# Altium schematic sheet USB Type C Connector ESD.SchDoc
size Tabloid; ApprovedBy: NA
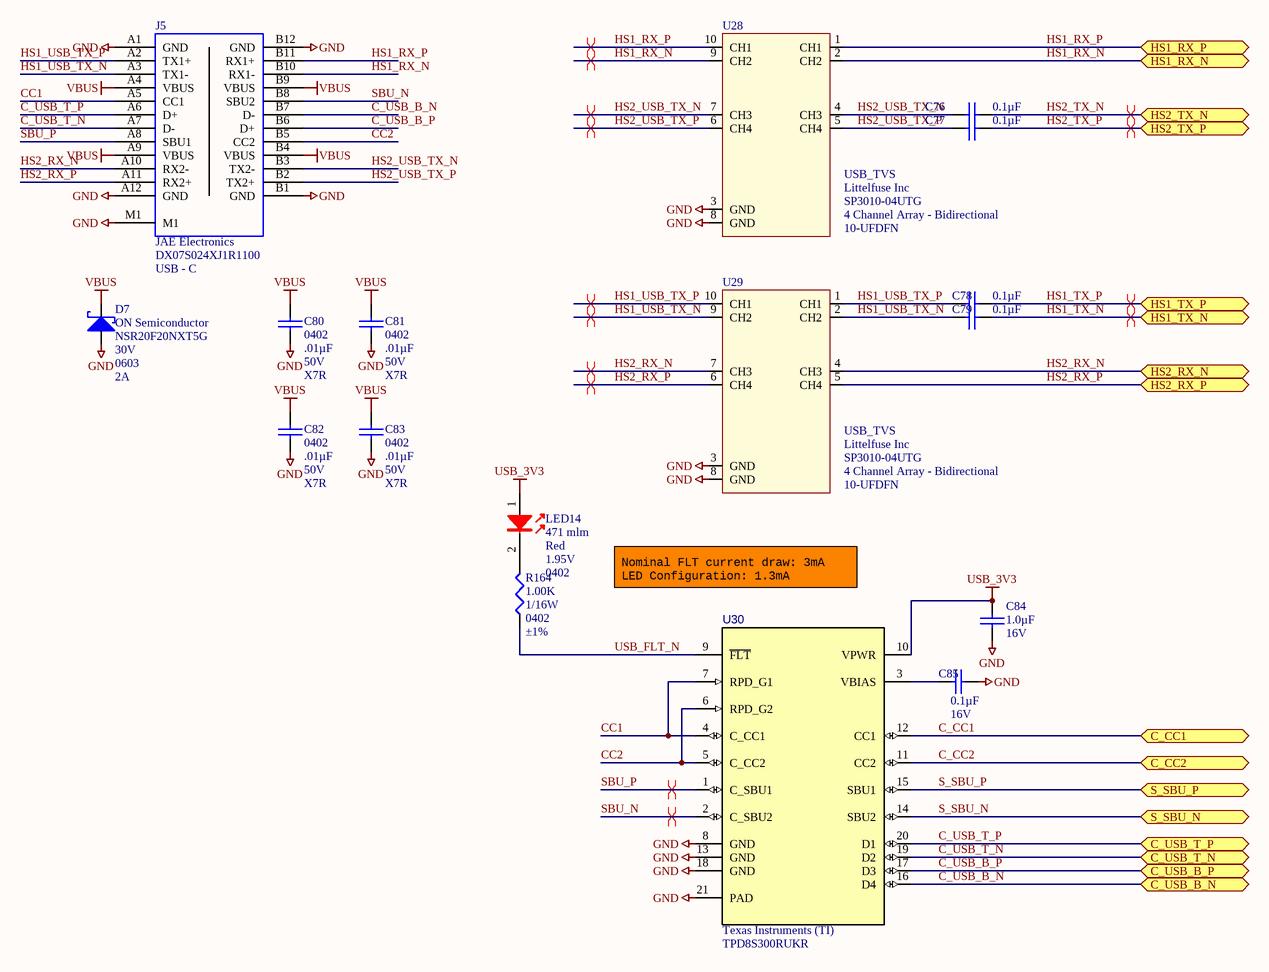
[diagram p0: USB Type C Connector ESD.SchDoc]

## Parts
C76  Capacitance: 0.1µF  [CAPC0201]  (hidden comment: 0.1UF)
C77  Capacitance: 0.1µF  [CAPC0201]  (hidden comment: 0.1UF)
C78  Capacitance: 0.1µF  [CAPC0201]  (hidden comment: 0.1UF)
C79  Capacitance: 0.1µF  [CAPC0201]  (hidden comment: 0.1UF)
C80  Package / Case: 0402  Capacitance: .01µF  Voltage - Rated: 50V  Temperature Coefficient: X7R  [C_ERA-0402]  (hidden comment: 10000pF)
C81  Package / Case: 0402  Capacitance: .01µF  Voltage - Rated: 50V  Temperature Coefficient: X7R  [C_ERA-0402]  (hidden comment: 10000pF)
C82  Package / Case: 0402  Capacitance: .01µF  Voltage - Rated: 50V  Temperature Coefficient: X7R  [C_ERA-0402]  (hidden comment: 10000pF)
C83  Package / Case: 0402  Capacitance: .01µF  Voltage - Rated: 50V  Temperature Coefficient: X7R  [C_ERA-0402]  (hidden comment: 10000pF)
C84  Capacitance: 1.0µF  Voltage - Rated: 16V  [C_ERA-0402]  (hidden comment: 1.0uF)
C85  Capacitance: 0.1µF  Voltage - Rated: 16V  [C_0402]  (hidden comment: 0.1uF)
D7  Reverse Voltage (DC): 30V  Manufacturer: ON Semiconductor  Manufacturer Part Number: NSR20F20NXT5G  Case/Package: 0603  Average Rectified Current: 2A  [DSN2_0603]  (hidden comment: D_SCHOTT_30V_2A_XDFN)
J5  Manufacturer: JAE Electronics  Connector Type: USB - C  [DX07S024XJ1R1100]  (hidden comment: J_DX07S024XJ1R1100)
LED14  Luminous Flux @ Current - Test: 471 mlm  Color: Red  Voltage - Forward (Vf) Typ: 1.95V  Package / Case: 0402  [DIOM1005X07L_RED]  (hidden comment: LED_RED_0402)
R164  Resistance In Ohms: 1.00K  Power (Watts): 1/16W  Case: 0402  Tolerance: ±1%  [R_0402]  (hidden comment: 1.0k Ohms)
U28  USB_TVS  Manufacturer: Littelfuse Inc  Manufacturer Part Number: SP3010-04UTG  Polarization: 4 Channel Array - Bidirectional  Package / Case: 10-UFDFN  [TVS_DIODE_USB3.0-10]
U29  USB_TVS  Manufacturer: Littelfuse Inc  Manufacturer Part Number: SP3010-04UTG  Polarization: 4 Channel Array - Bidirectional  Package / Case: 10-UFDFN  [TVS_DIODE_USB3.0-10]
U30  Manufacturer: Texas Instruments (TI)  Manufacturer Part Number: TPD8S300RUKR  [RUK0020B]  (hidden comment: U_TPD8S300RUK)

## Ports
C_CC1, C_CC2, C_USB_B_N, C_USB_B_P, C_USB_T_N, C_USB_T_P, HS1_RX_N, HS1_RX_P, HS1_TX_N, HS1_TX_P, HS2_RX_N, HS2_RX_P, HS2_TX_N, HS2_TX_P, S_SBU_N, S_SBU_P

## Nets
GND: C80.1 C81.1 C82.1 C83.1 C84.1 C85.1 D7.A J5.A1(GND) J5.A12(GND) J5.B1(GND) J5.B12(GND) J5.M1 U28.3(GND) U28.8(GND) U29.3(GND) U29.8(GND) U30.8(GND) U30.13(GND) U30.18(GND) U30.21(PAD)
USB_3V3: C84.2 LED14.1 U30.10(VPWR)
VBUS: C80.2 C81.2 C82.2 C83.2 D7.C J5.A4(VBUS) J5.A9(VBUS) J5.B4(VBUS) J5.B9(VBUS)
C_CC1: U30.12(CC1) ; port C_CC1
C_CC2: U30.11(CC2) ; port C_CC2
C_USB_B_N: J5.B7(D-) U30.16(D4) ; port C_USB_B_N
C_USB_B_P: J5.B6(D+) U30.17(D3) ; port C_USB_B_P
C_USB_T_N: J5.A7(D-) U30.19(D2) ; port C_USB_T_N
C_USB_T_P: J5.A6(D+) U30.20(D1) ; port C_USB_T_P
CC1: J5.A5(CC1) U30.4(C_CC1) U30.7(RPD_G1)
CC2: J5.B5(CC2) U30.5(C_CC2) U30.6(RPD_G2)
HS1_RX_N: J5.B10(RX1-) U28.2(CH2) U28.9(CH2) ; port HS1_RX_N
HS1_RX_P: J5.B11(RX1+) U28.1(CH1) U28.10(CH1) ; port HS1_RX_P
HS1_TX_N: C79.2 ; port HS1_TX_N
HS1_TX_P: C78.2 ; port HS1_TX_P
HS1_USB_TX_N: C79.1 J5.A3(TX1-) U29.2(CH2) U29.9(CH2)
HS1_USB_TX_P: C78.1 J5.A2(TX1+) U29.1(CH1) U29.10(CH1)
HS2_RX_N: J5.A10(RX2-) U29.4(CH3) U29.7(CH3) ; port HS2_RX_N
HS2_RX_P: J5.A11(RX2+) U29.5(CH4) U29.6(CH4) ; port HS2_RX_P
HS2_TX_N: C76.2 ; port HS2_TX_N
HS2_TX_P: C77.2 ; port HS2_TX_P
HS2_USB_TX_N: C76.1 J5.B3(TX2-) U28.4(CH3) U28.7(CH3)
HS2_USB_TX_P: C77.1 J5.B2(TX2+) U28.5(CH4) U28.6(CH4)
S_SBU_N: U30.14(SBU2) ; port S_SBU_N
S_SBU_P: U30.15(SBU1) ; port S_SBU_P
SBU_N: J5.B8(SBU2) U30.2(C_SBU2)
SBU_P: J5.A8(SBU1) U30.1(C_SBU1)
USB_FLT_N: R164.2 U30.9(~{FLT})
NetC85_2: C85.2 U30.3(VBIAS)
NetLED14_2: LED14.2 R164.1

## Layout directives
differential pair: HS1_RX_N, HS1_RX_P, HS1_TX_N, HS1_TX_P, HS1_USB_TX_N, HS1_USB_TX_P, HS2_RX_N, HS2_RX_P, HS2_TX_N, HS2_TX_P, HS2_USB_TX_N, HS2_USB_TX_P, SBU_N, SBU_P

## Notes on the sheet
- Nominal FLT current draw: 3mA
  LED Configuration: 1.3mA
- Project:
- http://www.cospandesign.com
- Cospan Design
- Document:
- Engineer:
- Title:
- Client:
- Approved By:
- Revision:
- Date:
- Number:
- of

## Library data of the parts
C76-C79 = C_0201_0.1UF: CAP CER 0.1UF 6.3V 10% X5R 0201; Manufacturer: TDK Corporation; Manufacturer Part Number: C0603X5R0J104M; Tolerance: ±20%; Supplier 1: Digi-Key; Supplier Part Number 1: 445-4711-1-ND; RoHS: RoHS Compliant; Category: Capacitors; Stock 1: 195192; Pricing: 10=0.032, 100=0.0149, 250=0.01216, 500=0.0104, 1000=0.0081, 5000=0.00675 (USD); Mounting Type: Surface Mount, MLCC; Operating Temperature: -55°C ~ 85°C; Applications: General Purpose; Ratings: -; Size / Dimension: 0.024" L x 0.012" W (0.60mm x 0.30mm); Height - Seated (Max): -; Thickness (Max): 0.013" (0.33mm); Lead Spacing: -; Features: -; Packaging: Cut Tape (CT); Lead Style: -; ComponentLink1URL: http://www.tdk.com/pdf/general_B11.pdf; ComponentLink1Description: http://www.tdk.com/pdf/general_B11.pdf; Voltage - Rated: 6.3V; Temperature Coefficient: X5R; Package / Case: 0201
C80-C83 = C_0402_10000PF_50V: CAP CERAMIC .01UF 50V X7R 0402; Manufacturer: Murata Electronics North America; Manufacturer Part Number: GRM155R71H103KA88D; Tolerance: ±10%; Supplier 1: Digi-Key; RoHS: RoHS Compliant; Category: Capacitors; Stock 1: 7255009; Pricing 1: 1=0.1, 50=0.0052, 100=0.0044, 250=0.00364, 500=0.00312, 1000=0.00242, 5000=0.00202 (USD); Packaging: Cut Tape (CT); Part Status: Active; Operating Temperature: -55°C ~ 125°C; Features: -; Ratings: -; Applications: General Purpose; Mounting Type: Surface Mount, MLCC; Size / Dimension: 0.039" L x 0.020" W (1.00mm x 0.50mm); Height - Seated (Max): -; Thickness (Max): 0.022" (0.55mm); Lead Spacing: -; Lead Style: -; ComponentLink1URL: http://www.murata.com/~/media/webrenewal/support/library/catalog/products/capacitor/mlcc/c02e.ashx; ComponentLink1Description: http://www.murata.com/~/media/webrenewal/support/library/catalog/products/capacitor/mlcc/c02e.ashx; Supplier Part Number 1: 490-4516-1-ND
C84 = C_0402_1.0UF_16V: CAP CER 1.0UF 16V X5R 0402; Manufacturer: TDK Corporation; Manufacturer Part Number: C1005X5R1C105K050BC; Tolerance: ±10%; Supplier 1: Digi-Key; RoHS: RoHS Compliant; Category: Capacitors; Stock 1: 32791; Pricing 1: 1=0.12, 10=0.081, 100=0.0384, 250=0.03232, 500=0.02706, 1000=0.02222, 5000=0.01879 (USD); Packaging: Cut Tape (CT); Part Status: Obsolete; Operating Temperature: -55°C ~ 85°C; Features: Low ESL; Ratings: -; Applications: General Purpose; Failure Rate: -; Mounting Type: Surface Mount, MLCC; Size / Dimension: 0.039" L x 0.020" W (1.00mm x 0.50mm); Height - Seated (Max): -; Thickness (Max): 0.022" (0.55mm); Lead Spacing: -; Lead Style: -; ComponentLink1URL: https://product.tdk.com/info/en/catalog/datasheets/mlcc_commercial_general_en.pdf; ComponentLink1Description: https://product.tdk.com/info/en/catalog/datasheets/mlcc_commercial_general_en.pdf; Supplier Part Number 1: 445-4978-1-ND; Temperature Coefficient: X5R; Package / Case: 0402
C85 = C_0402_0.1UF_16V: CAP CER .10UF 16V X7R 0402; Manufacturer: TDK Corporation; Manufacturer Part Number: C1005X7R1C104K050BC; Tolerance: ±10%; Supplier 1: Digi-Key; RoHS: RoHS Compliant; Category: Capacitors; Stock 1: 2696686; Pricing 1: 1=0.1, 10=0.05, 100=0.0231, 250=0.01892, 500=0.01618, 1000=0.0126, 5000=0.0105 (USD); Packaging: Cut Tape (CT); Part Status: Not For New Designs; Operating Temperature: -55°C ~ 125°C; Features: Low ESL; Ratings: -; Applications: General Purpose; Failure Rate: -; Mounting Type: Surface Mount, MLCC; Size / Dimension: 0.039" L x 0.020" W (1.00mm x 0.50mm); Height - Seated (Max): -; Thickness (Max): 0.022" (0.55mm); Lead Spacing: -; Lead Style: -; ComponentLink1URL: https://product.tdk.com/info/en/catalog/datasheets/mlcc_commercial_general_en.pdf; ComponentLink1Description: https://product.tdk.com/info/en/catalog/datasheets/mlcc_commercial_general_en.pdf; Supplier Part Number 1: 445-4952-1-ND; Temperature Coefficient: X7R; Package / Case: 0402
D7 = D_SCHOTT_30V_2A_XDFN: Diode Schottky 30V 2A (DC) Surface Mount 2-DSN (1.6x.80); Max Surge Current: 28A; Peak Reverse Current: 150uA; Forward Voltage: 480mV; Max Power Dissipation: 1.75W; Element Configuration: Single; Supplier 1: Digikey; Stock 1: 24771; Pricing 1: 1=0.57, 10=0.458, 100=0.3118, 500=0.2339, 1000=0.1754 (USD); Number of Pins: 2; Min Operating Temperature: -40°C; Max Operating Temperature: 150°C; Forward Current: 2A; Package Quantity: 1; Packaging: Tape and Reel; Max Reverse Leakage Current: 150uA; Max Repetitive Reverse Voltage (Vrrm): 30V; Max Forward Surge Current (Ifsm): 28A; Peak Non-Repetitive Surge Current: 28A; Radiation Hardening: No; REACH SVHC: No SVHC; Lead Free: Lead Free; ComponentLink1URL: https://datasheet.ciiva.com/22663/nsr20f30-d-22663701.pdf; ComponentLink1Description: https://datasheet.ciiva.com/22663/nsr20f30-d-22663701.pdf; ComponentLink2URL: https://datasheet.ciiva.com/4714/nsr20f30-118998-4714087.pdf; ComponentLink2Description: https://datasheet.ciiva.com/4714/nsr20f30-118998-4714087.pdf; ComponentLink3URL: https://datasheet.ciiva.com/16474/nsr20f30-d-16474535.pdf; ComponentLink3Description: https://datasheet.ciiva.com/16474/nsr20f30-d-16474535.pdf; ComponentLink4URL: https://datasheet.ciiva.com/915/nsr20f30-d-915929.pdf; ComponentLink4Description: https://datasheet.ciiva.com/915/nsr20f30-d-915929.pdf; ComponentLink5URL: https://datasheet.ciiva.com/915/nsr20f30-d-915930.pdf; ComponentLink5Description: https://datasheet.ciiva.com/915/nsr20f30-d-915930.pdf; ComponentLink6URL: https://datasheet.ciiva.com/915/nsr20f30-d-915931.pdf; ComponentLink6Description: https://datasheet.ciiva.com/915/nsr20f30-d-915931.pdf; Supplier Part Number 1: NSR20F30NXT5GOSDKR-ND
J5 = J_DX07S024XJ1R1100: CONN RCPT USB C TOP MNT HYBRID; Number of Contacts: 24; Gender: Receptacle; Specifications: USB 3.1, Superspeed+; Supplier 1: Digi-Key; RoHS: RoHS Compliant; Category: Connectors, Interconnects; Stock 1: 1709; Pricing 1: 1=2.85, 10=2.587, 25=2.4288, 50=2.3232, 100=2.2176, 250=2.0064, 500=1.848 (USD); Packaging: Cut Tape (CT); Part Status: Active; Mounting Type: Surface Mount, Right Angle; Through Hole; Features: Board Guide; Ingress Protection: -; ComponentLink1URL: http://media.digikey.com/pdf/Data%20Sheets/JAE%20PDFs/DX07S024XJ1_Dwg.pdf; ComponentLink1Description: http://media.digikey.com/pdf/Data%20Sheets/JAE%20PDFs/DX07S024XJ1_Dwg.pdf; Supplier Part Number 1: 670-2848-1-ND; Manufacturer Part Number: DX07S024XJ1R1100
LED14 = LED_RED_0402: LED 1X0.5MM 630NM RD WTR CLR SMD; Manufacturer: Kingbright Corp; Manufacturer Part Number: APHHS1005SURCK; Current - Test: 20mA; Wavelength - Peak: 650nm; Millicandela Rating: 150mcd; Lens Type: Clear; Lens Style/Size: Rectangle, 0.8mm x 0.5mm; Viewing Angle: 120°; Supplier 1: Digi-Key; Supplier Part Number 1: 754-1104-1-ND; RoHS: RoHS Compliant; Category: Optoelectronics; Stock 1: 32842; Pricing 1: 1=0.3, 10=0.221, 25=0.1772, 100=0.1623, 250=0.14752, 500=0.13276, 1000=0.118 (USD); Wavelength - Dominant: 630nm; Mounting Type: Surface Mount; Packaging: Cut Tape (CT); ComponentLink1URL: http://www.us.kingbright.com/images/catalog/SPEC/APHHS1005SURCK.pdf; ComponentLink1Description: http://www.us.kingbright.com/images/catalog/SPEC/APHHS1005SURCK.pdf
R164 = R_0402_1.0K: RES 1.00K OHM 1/16W 1% 0402 SMD; Manufacturer: Yageo; Manufacturer Part Number: RC0402FR-071KL; Resistance (Ohms): 1K; Temperature Coefficient: ±100ppm/°C; Supplier 1: Digi-Key; Supplier Part Number 1: 311-1.00KLRCT-ND; RoHS: RoHS Compliant; Category: Resistors; Stock 1: 2103351; Pricing: 10=0.014, 100=0.0063, 500=0.00382, 1000=0.0027, 5000=0.00203 (USD); Composition: Thick Film; Features: -; Package / Case: 0402 (1005 Metric); Size / Dimension: 0.039" L x 0.020" W (1.00mm x 0.50mm); Height: 0.016" (0.40mm); Number of Terminations: 2; Packaging: Cut Tape (CT); ComponentLink1URL: http://www.yageo.com/documents/recent/PYu-RC0402_51_RoHS_L_6.pdf; ComponentLink1Description: http://www.yageo.com/documents/recent/PYu-RC0402_51_RoHS_L_6.pdf
U28 U29 = U_SP3010-04UTG: TVS ARRAY ESD 4CH .45PF 8KV UDFN; Voltage - Reverse Standoff (Typ): 6V; Supplier 1: Digi-Key; Supplier Part Number 1: F3507CT-ND; RoHS: RoHS Compliant; Category: Circuit Protection; Stock 1: 1559; Pricing: 1=0.99, 10=0.866, 25=0.7656, 100=0.6672, 250=0.5808, 500=0.4944, 1000=0.396 (USD); Voltage - Breakdown: -; Power (Watts): -; Mounting Type: Surface Mount; Supplier Device Package: 10-µDFN (2.5x1.0); Packaging: Cut Tape (CT); ComponentLink1URL: http://www.littelfuse.com/data/en/Data_Sheets/Littelfuse_TVS_Diode_Array_SPA_SP3010.pdf; ComponentLink1Description: http://www.littelfuse.com/data/en/Data_Sheets/Littelfuse_TVS_Diode_Array_SPA_SP3010.pdf
U30 = U_TPD8S300RUK: USB Type C Interface Protector: Short-to-VBUS Over Voltage and IEC 61000-4-2 ESD Protection, RUK0020B; Capacitance: 1.5pF; Supplier 1: Digi-Key; Stock 1: 2830; Pricing 1: 1=2.65, 10=2.377, 100=1.9109, 500=1.57, 1000=1.3008 (USD); Lead Free: Lead Free; Supplier Part Number 1: 296-45177-6-ND